# EAGLE schematic Basis_WeMos v1 (EAGLE 9.7.0)
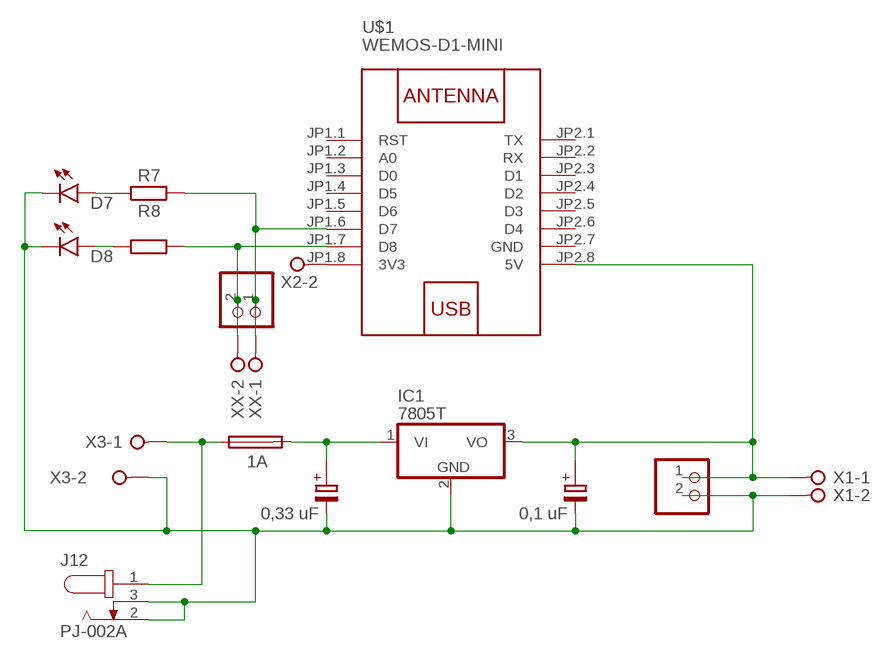
[diagram p0: schematic, sheet 1]

## Parts
1A  SH25  [SH25]
C3  0,33 uF  C-PR-2,0X5  [E2,0-5]
C4  0,1 uF  C-PR-2,0X5  [E2,0-5]
D7  LED_BLUE  LED_RADIAL_BLUE  [LEDRD254W60D565H860B_B]
D8  LED_YELLOW  LED_RADIAL_YELLOW  [LEDRD254W60D565H860B_Y]
IC1  7805T  [TO220H]
J12  PJ-002A  [CUI_PJ-002A]
JP8  PINHD-1X2  [1X02]
JP9  PINHD-1X2  [1X02]
R7  100 Ω  R_AXIAL-11.7MM-PITCH  [RESAD1176W63L850D250B]
R8  100 Ω  R_AXIAL-11.7MM-PITCH  [RESAD1176W63L850D250B]
U$1  WEMOS-D1-MINI  [WEMOS-D1-MINI]
X1  W237-02P  [W237-132]
X2  W237-02P  [W237-132]
X3  W237-02P  [W237-132]
XX  W237-02P  [W237-132]

## Nets
N$8: JP8.1 R7.2 U$1.JP1.6(D7) XX.1
N$10: JP8.2 R8.2 U$1.JP1.7(D8) XX.2
N$14: 1A.1 J12.1 X3.1
N$24: 1A.2 C3.+ IC1.1(VI)
N$25: C3.- C4.- D7.2(C) D8.2(C) IC1.2(GND) J12.2 J12.3 JP9.2 X1.2 X3.2
N$27: C4.+ IC1.3(VO) JP9.1 U$1.JP2.8(5V) X1.1
N$33: D7.1(A) R7.1
N$34: D8.1(A) R8.1
N$38: U$1.JP1.8(3V3) X2.2
Unconnected: U$1.JP1.1(RST) U$1.JP1.2(A0) U$1.JP1.3(D0) U$1.JP1.4(D5) U$1.JP1.5(D6) U$1.JP2.1(TX) U$1.JP2.2(RX) U$1.JP2.3(D1) U$1.JP2.4(D2) U$1.JP2.5(D3) U$1.JP2.6(D4) X2.1

## Power pins joined to a net without a drawn wire
GND: U$1.JP2.7(GND)

## Library data of the parts
1A = fuse:SH25: FUSE HOLDER grid 25 mm, OGN0031 8211, Schurter (Buerklin); MF: SCHURTER; MPN: 0031.8211; OC_FARNELL: 1162741; OC_NEWARK: 96B9380
C3 C4 = cap-pan40:C-PR: POLARIZED ELECTROLYTIC/TANTALUM
D7 D8 = Opto-Electronic:LED_RADIAL: LED - Generic; CATEGORY: Opto-Electronic; SUB-CATEGORY: LED
IC1 = adafruit:78*: Positive VOLTAGE REGULATOR Added bigger pads to the TO-92 package
J12 = DC_Connector:PJ-002A: 2.0 mm Center Pin, 2.5 A, Right Angle, Through Hole, Dc Power Jack Connector; MANUFACTURER: CUI INC; STANDARD: Manufacturer recommendations
JP8 JP9 = Connector:PINHD-1X2: PIN HEADER; CATEGORY: CONNECTOR; SUB-CATEGORY: PIN-HEADER
R7 R8 = Resistor:R: Resistor Fixed - Generic; CATEGORY: Resistor; SUB-CATEGORY: Fixed
U$1 = diy-modules:WEMOS-D1-MINI: WEMOS D1 mini: Mini Wi-Fi Board based on ESP-8266 device More details can be found here: https://www.wemos.cc/product/d1-mini.html Click here to find device on ebay.com <http://www.ebay.com/sch/wemos+d1+mini+nodemcu>
X1-X3 XX = con-wago-508:W237-02P: WAGO SREW CLAMP; OC_FARNELL: unknown; OC_NEWARK: unknown